# EAGLE design CaravanPi_V4 (EAGLE 9.6.2)
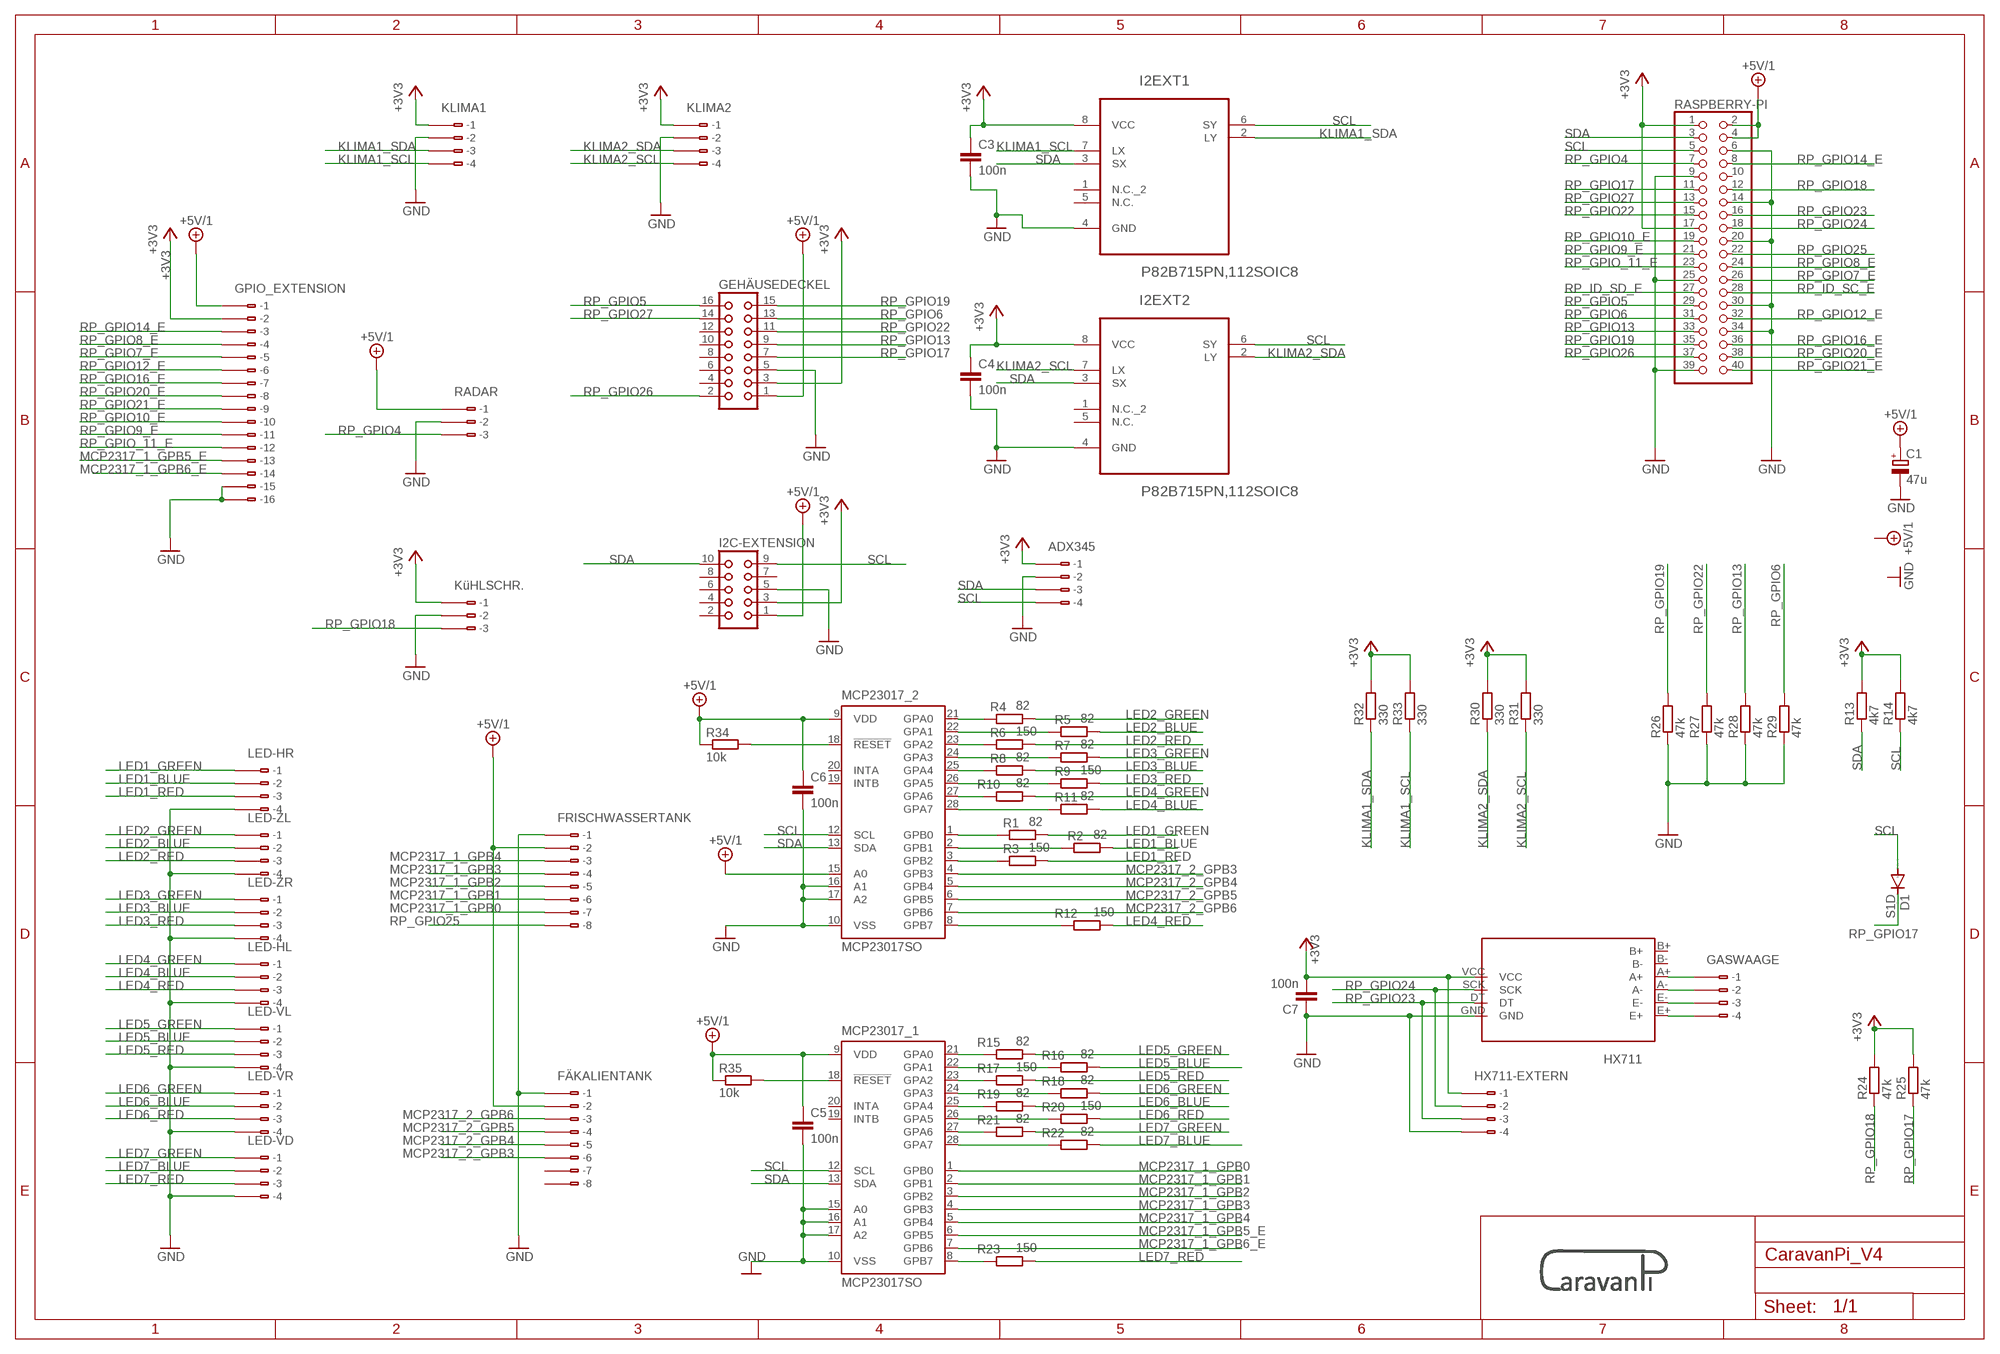
[diagram p0: schematic, sheet 1]

## Parts
ADX345  233-404  [233-404]
C1  47u  CPOL-EUSMCC  [SMC_C]
C3  100n  C-EUC1206  [C1206]
C4  100n  C-EUC1206  [C1206]
C5  100n  C-EUC1206  [C1206]
C6  100n  C-EUC1206  [C1206]
C7  100n  C-EUC1206  [C1206]
D1  S1D  DIODE-DO214AC  [DO214AC]
FRISCHWASSERTANK  233-408  [233-408]
FÄKALIENTANK  233-408  [233-408]
GASWAAGE  233-404  [233-404]
GEHÄUSEDECKEL  CON16  [CON16]
GPIO_EXTENSION  233-516  [233-516]
HX711  HX711A  [HX711]
HX711-EXTERN  233-404  [233-404]
I2C-EXTENSION  CON10  [CON10]
I2EXT1  P82B715PN,112SOIC8  [SOP127P600X175-8N]
I2EXT2  P82B715PN,112SOIC8  [SOP127P600X175-8N]
KLIMA1  233-404  [233-404]
KLIMA2  233-404  [233-404]
KüHLSCHR.  233-403  [233-403]
LED-HL  233-504  [233-504]
LED-HR  233-504  [233-504]
LED-VD  233-504  [233-504]
LED-VL  233-504  [233-504]
LED-VR  233-504  [233-504]
LED-ZL  233-504  [233-504]
LED-ZR  233-504  [233-504]
MCP23017_1  MCP23017SO  [SO28W]
MCP23017_2  MCP23017SO  [SO28W]
R1  82  R-EU_M1206  [M1206]
R2  82  R-EU_M1206  [M1206]
R3  150  R-EU_M1206  [M1206]
R4  82  R-EU_M1206  [M1206]
R5  82  R-EU_M1206  [M1206]
R6  150  R-EU_M1206  [M1206]
R7  82  R-EU_M1206  [M1206]
R8  82  R-EU_M1206  [M1206]
R9  150  R-EU_M1206  [M1206]
R10  82  R-EU_M1206  [M1206]
R11  82  R-EU_M1206  [M1206]
R12  150  R-EU_M1206  [M1206]
R13  4k7  R-EU_M1206  [M1206]
R14  4k7  R-EU_M1206  [M1206]
R15  82  R-EU_M1206  [M1206]
R16  82  R-EU_M1206  [M1206]
R17  150  R-EU_M1206  [M1206]
R18  82  R-EU_M1206  [M1206]
R19  82  R-EU_M1206  [M1206]
R20  150  R-EU_M1206  [M1206]
R21  82  R-EU_M1206  [M1206]
R22  82  R-EU_M1206  [M1206]
R23  150  R-EU_M1206  [M1206]
R24  47k  R-EU_M1206  [M1206]
R25  47k  R-EU_M1206  [M1206]
R26  47k  R-EU_M1206  [M1206]
R27  47k  R-EU_M1206  [M1206]
R28  47k  R-EU_M1206  [M1206]
R29  47k  R-EU_M1206  [M1206]
R30  330  R-EU_M1206  [M1206]
R31  330  R-EU_M1206  [M1206]
R32  330  R-EU_M1206  [M1206]
R33  330  R-EU_M1206  [M1206]
R34  10k  R-EU_M1206  [M1206]
R35  10k  R-EU_M1206  [M1206]
RADAR  233-403  [233-403]
RASPBERRY-PI  PINHD-2X20  [2X20]
U$1  CARAVAN_PI_LOGO  [CARAVAN_PI_LOGO]

## Nets
+3V3 [Power]: ADX345.B1(B-1) C3.1 C4.1 C7.2 GEHÄUSEDECKEL.3 GPIO_EXTENSION.B2(B-2) HX711-EXTERN.B1(B-1) HX711.VCC I2C-EXTENSION.3 I2EXT1.8(VCC) I2EXT2.8(VCC) KLIMA1.B1(B-1) KLIMA2.B1(B-1) KüHLSCHR..B1(B-1) R13.2 R14.2 R24.2 R25.2 R30.2 R31.2 R32.2 R33.2 RASPBERRY-PI.1 RASPBERRY-PI.17
+5V/1 [Power]: C1.+ C5.1 C6.1 FRISCHWASSERTANK.B2(B-2) FÄKALIENTANK.B2(B-2) GEHÄUSEDECKEL.1 GPIO_EXTENSION.B1(B-1) I2C-EXTENSION.1 MCP23017_1.9(VDD) MCP23017_2.9(VDD) MCP23017_2.15(A0) R34.1 R35.1 RADAR.B1(B-1) RASPBERRY-PI.2 RASPBERRY-PI.4
GND [Power]: ADX345.B2(B-2) C1.- C3.2 C4.2 C5.2 C6.2 C7.1 FRISCHWASSERTANK.B1(B-1) FÄKALIENTANK.B1(B-1) GEHÄUSEDECKEL.5 GPIO_EXTENSION.B15(B-15) GPIO_EXTENSION.B16(B-16) HX711-EXTERN.B4(B-4) HX711.GND I2C-EXTENSION.5 I2EXT1.4(GND) I2EXT2.4(GND) KLIMA1.B2(B-2) KLIMA2.B2(B-2) KüHLSCHR..B2(B-2) LED-HL.B4(B-4) LED-HR.B4(B-4) LED-VD.B4(B-4) LED-VL.B4(B-4) LED-VR.B4(B-4) LED-ZL.B4(B-4) LED-ZR.B4(B-4) MCP23017_1.10(VSS) MCP23017_1.15(A0) MCP23017_1.16(A1) MCP23017_1.17(A2) MCP23017_2.10(VSS) MCP23017_2.16(A1) MCP23017_2.17(A2) R26.1 R27.1 R28.1 R29.1 RADAR.B2(B-2) RASPBERRY-PI.6 RASPBERRY-PI.9 RASPBERRY-PI.14 RASPBERRY-PI.20 RASPBERRY-PI.25 RASPBERRY-PI.30 RASPBERRY-PI.34 RASPBERRY-PI.39
KLIMA1_SCL: I2EXT1.7(LX) KLIMA1.B4(B-4) R33.1
KLIMA1_SDA: I2EXT1.2(LY) KLIMA1.B3(B-3) R32.1
KLIMA2_SCL: I2EXT2.7(LX) KLIMA2.B4(B-4) R31.1
KLIMA2_SDA: I2EXT2.2(LY) KLIMA2.B3(B-3) R30.1
LED1_BLUE: LED-HR.B2(B-2) R2.2
LED1_GREEN: LED-HR.B1(B-1) R1.2
LED1_RED: LED-HR.B3(B-3) R3.2
LED2_BLUE: LED-ZL.B2(B-2) R5.2
LED2_GREEN: LED-ZL.B1(B-1) R4.2
LED2_RED: LED-ZL.B3(B-3) R6.2
LED3_BLUE: LED-ZR.B2(B-2) R8.2
LED3_GREEN: LED-ZR.B1(B-1) R7.2
LED3_RED: LED-ZR.B3(B-3) R9.2
LED4_BLUE: LED-HL.B2(B-2) R11.2
LED4_GREEN: LED-HL.B1(B-1) R10.2
LED4_RED: LED-HL.B3(B-3) R12.2
LED5_BLUE: LED-VL.B2(B-2) R16.2
LED5_GREEN: LED-VL.B1(B-1) R15.2
LED5_RED: LED-VL.B3(B-3) R17.2
LED6_BLUE: LED-VR.B2(B-2) R19.2
LED6_GREEN: LED-VR.B1(B-1) R18.2
LED6_RED: LED-VR.B3(B-3) R20.2
LED7_BLUE: LED-VD.B2(B-2) R22.2
LED7_GREEN: LED-VD.B1(B-1) R21.2
LED7_RED: LED-VD.B3(B-3) R23.2
MCP2317_1_GPB0: FRISCHWASSERTANK.B7(B-7) MCP23017_1.1(GPB0)
MCP2317_1_GPB1: FRISCHWASSERTANK.B6(B-6) MCP23017_1.2(GPB1)
MCP2317_1_GPB2: FRISCHWASSERTANK.B5(B-5) MCP23017_1.3(GPB2)
MCP2317_1_GPB3: FRISCHWASSERTANK.B4(B-4) MCP23017_1.4(GPB3)
MCP2317_1_GPB4: FRISCHWASSERTANK.B3(B-3) MCP23017_1.5(GPB4)
MCP2317_1_GPB5_E: GPIO_EXTENSION.B13(B-13) MCP23017_1.6(GPB5)
MCP2317_1_GPB6_E: GPIO_EXTENSION.B14(B-14) MCP23017_1.7(GPB6)
MCP2317_2_GPB3: FÄKALIENTANK.B6(B-6) MCP23017_2.4(GPB3)
MCP2317_2_GPB4: FÄKALIENTANK.B5(B-5) MCP23017_2.5(GPB4)
MCP2317_2_GPB5: FÄKALIENTANK.B4(B-4) MCP23017_2.6(GPB5)
MCP2317_2_GPB6: FÄKALIENTANK.B3(B-3) MCP23017_2.7(GPB6)
N$1: MCP23017_2.1(GPB0) R1.1
N$2: MCP23017_2.2(GPB1) R2.1
N$3: MCP23017_2.3(GPB2) R3.1
N$4: MCP23017_2.21(GPA0) R4.1
N$5: MCP23017_2.22(GPA1) R5.1
N$6: MCP23017_2.23(GPA2) R6.1
N$7: MCP23017_2.24(GPA3) R7.1
N$8: MCP23017_2.25(GPA4) R8.1
N$9: MCP23017_2.26(GPA5) R9.1
N$10: MCP23017_2.27(GPA6) R10.1
N$11: MCP23017_2.28(GPA7) R11.1
N$12: MCP23017_2.8(GPB7) R12.1
N$13: MCP23017_1.21(GPA0) R15.1
N$14: MCP23017_1.22(GPA1) R16.1
N$15: MCP23017_1.23(GPA2) R17.1
N$16: MCP23017_1.24(GPA3) R18.1
N$17: MCP23017_1.25(GPA4) R19.1
N$18: MCP23017_1.26(GPA5) R20.1
N$19: MCP23017_1.27(GPA6) R21.1
N$20: MCP23017_1.28(GPA7) R22.1
N$21: MCP23017_2.18(!RESET) R34.2
N$22: MCP23017_1.18(!RESET) R35.2
N$23: GASWAAGE.B4(B-4) HX711.E+
N$24: GASWAAGE.B3(B-3) HX711.E-
N$25: GASWAAGE.B2(B-2) HX711.A-
N$26: GASWAAGE.B1(B-1) HX711.A+
N$29: MCP23017_1.8(GPB7) R23.1
RP_GPIO4: RADAR.B3(B-3) RASPBERRY-PI.7
RP_GPIO5: GEHÄUSEDECKEL.16 RASPBERRY-PI.29
RP_GPIO6: GEHÄUSEDECKEL.13 R29.2 RASPBERRY-PI.31
RP_GPIO7_E: GPIO_EXTENSION.B5(B-5) RASPBERRY-PI.26
RP_GPIO8_E: GPIO_EXTENSION.B4(B-4) RASPBERRY-PI.24
RP_GPIO9_E: GPIO_EXTENSION.B11(B-11) RASPBERRY-PI.21
RP_GPIO10_E: GPIO_EXTENSION.B10(B-10) RASPBERRY-PI.19
RP_GPIO12_E: GPIO_EXTENSION.B6(B-6) RASPBERRY-PI.32
RP_GPIO13: GEHÄUSEDECKEL.9 R28.2 RASPBERRY-PI.33
RP_GPIO14_E: GPIO_EXTENSION.B3(B-3) RASPBERRY-PI.8
RP_GPIO16_E: GPIO_EXTENSION.B7(B-7) RASPBERRY-PI.36
RP_GPIO17: D1.C GEHÄUSEDECKEL.7 R25.1 RASPBERRY-PI.11
RP_GPIO18: KüHLSCHR..B3(B-3) R24.1 RASPBERRY-PI.12
RP_GPIO19: GEHÄUSEDECKEL.15 R26.2 RASPBERRY-PI.35
RP_GPIO20_E: GPIO_EXTENSION.B8(B-8) RASPBERRY-PI.38
RP_GPIO21_E: GPIO_EXTENSION.B9(B-9) RASPBERRY-PI.40
RP_GPIO22: GEHÄUSEDECKEL.11 R27.2 RASPBERRY-PI.15
RP_GPIO23: HX711-EXTERN.B3(B-3) HX711.DT RASPBERRY-PI.16
RP_GPIO24: HX711-EXTERN.B2(B-2) HX711.SCK RASPBERRY-PI.18
RP_GPIO25: FRISCHWASSERTANK.B8(B-8) RASPBERRY-PI.22
RP_GPIO26: GEHÄUSEDECKEL.2 RASPBERRY-PI.37
RP_GPIO27: GEHÄUSEDECKEL.14 RASPBERRY-PI.13
RP_GPIO_11_E: GPIO_EXTENSION.B12(B-12) RASPBERRY-PI.23
RP_ID_SC_E: RASPBERRY-PI.28
RP_ID_SD_E: RASPBERRY-PI.27
SCL: ADX345.B4(B-4) D1.A I2C-EXTENSION.9 I2EXT1.6(SY) I2EXT2.6(SY) MCP23017_1.12(SCL) MCP23017_2.12(SCL) R14.1 RASPBERRY-PI.5
SDA: ADX345.B3(B-3) I2C-EXTENSION.10 I2EXT1.3(SX) I2EXT2.3(SX) MCP23017_1.13(SDA) MCP23017_2.13(SDA) R13.1 RASPBERRY-PI.3
Unconnected: ADX345.A1(-1) ADX345.A2(-2) ADX345.A3(-3) ADX345.A4(-4) FRISCHWASSERTANK.A1(-1) FRISCHWASSERTANK.A2(-2) FRISCHWASSERTANK.A3(-3) FRISCHWASSERTANK.A4(-4) FRISCHWASSERTANK.A5(-5) FRISCHWASSERTANK.A6(-6) FRISCHWASSERTANK.A7(-7) FRISCHWASSERTANK.A8(-8) FÄKALIENTANK.A1(-1) FÄKALIENTANK.A2(-2) FÄKALIENTANK.A3(-3) FÄKALIENTANK.A4(-4) FÄKALIENTANK.A5(-5) FÄKALIENTANK.A6(-6) FÄKALIENTANK.A7(-7) FÄKALIENTANK.A8(-8) FÄKALIENTANK.B7(B-7) FÄKALIENTANK.B8(B-8) GASWAAGE.A1(-1) GASWAAGE.A2(-2) GASWAAGE.A3(-3) GASWAAGE.A4(-4) GEHÄUSEDECKEL.4 GEHÄUSEDECKEL.6 GEHÄUSEDECKEL.8 GEHÄUSEDECKEL.10 GEHÄUSEDECKEL.12 GPIO_EXTENSION.A1(-1) GPIO_EXTENSION.A2(-2) GPIO_EXTENSION.A3(-3) GPIO_EXTENSION.A4(-4) GPIO_EXTENSION.A5(-5) GPIO_EXTENSION.A6(-6) GPIO_EXTENSION.A7(-7) GPIO_EXTENSION.A8(-8) GPIO_EXTENSION.A9(-9) GPIO_EXTENSION.A10(-10) GPIO_EXTENSION.A11(-11) GPIO_EXTENSION.A12(-12) GPIO_EXTENSION.A13(-13) GPIO_EXTENSION.A14(-14) GPIO_EXTENSION.A15(-15) GPIO_EXTENSION.A16(-16) HX711-EXTERN.A1(-1) HX711-EXTERN.A2(-2) HX711-EXTERN.A3(-3) HX711-EXTERN.A4(-4) HX711.B+ HX711.B- I2C-EXTENSION.2 I2C-EXTENSION.4 I2C-EXTENSION.6 I2C-EXTENSION.7 I2C-EXTENSION.8 I2EXT1.1(N.C._2) I2EXT1.5(N.C.) I2EXT2.1(N.C._2) I2EXT2.5(N.C.) KLIMA1.A1(-1) KLIMA1.A2(-2) KLIMA1.A3(-3) KLIMA1.A4(-4) KLIMA2.A1(-1) KLIMA2.A2(-2) KLIMA2.A3(-3) KLIMA2.A4(-4) KüHLSCHR..A1(-1) KüHLSCHR..A2(-2) KüHLSCHR..A3(-3) LED-HL.A1(-1) LED-HL.A2(-2) LED-HL.A3(-3) LED-HL.A4(-4) LED-HR.A1(-1) LED-HR.A2(-2) LED-HR.A3(-3) LED-HR.A4(-4) LED-VD.A1(-1) LED-VD.A2(-2) LED-VD.A3(-3) LED-VD.A4(-4) LED-VL.A1(-1) LED-VL.A2(-2) LED-VL.A3(-3) LED-VL.A4(-4) LED-VR.A1(-1) LED-VR.A2(-2) LED-VR.A3(-3) LED-VR.A4(-4) LED-ZL.A1(-1) LED-ZL.A2(-2) LED-ZL.A3(-3) LED-ZL.A4(-4) LED-ZR.A1(-1) LED-ZR.A2(-2) LED-ZR.A3(-3) LED-ZR.A4(-4) MCP23017_1.19(INTB) MCP23017_1.20(INTA) MCP23017_2.19(INTB) MCP23017_2.20(INTA) RADAR.A1(-1) RADAR.A2(-2) RADAR.A3(-3) RASPBERRY-PI.10

## Library data of the parts
ADX345 GASWAAGE HX711-EXTERN KLIMA1 KLIMA2 = con-wago:233-404: WAGO Cage Clamp; MPN: 233-404; OC_FARNELL: 1601355; OC_NEWARK: 28K9077
C1 = rcl:CPOL-EU: POLARIZED CAPACITOR, European symbol
C3-C7 = rcl:C-EU: CAPACITOR, European symbol; SPICEPREFIX: C
D1 = diode:DIODE-: DIODE
FRISCHWASSERTANK FÄKALIENTANK = con-wago:233-408: WAGO Cage Clamp; MPN: 233-408; OC_FARNELL: 1601358; OC_NEWARK: 28K9080
GEHÄUSEDECKEL = con-harting:CON16: CONNECTOR; OC_FARNELL: unknown; OC_NEWARK: unknown
GPIO_EXTENSION = con-wago:233-516: WAGO Cage Clamp; MF: Wago Corporation; MPN: 0233-0516; OC_FARNELL: 1777103; OC_NEWARK: 79K2056
HX711 = HX711:HX711
I2C-EXTENSION = con-harting:CON10: CONNECTOR; OC_FARNELL: unknown; OC_NEWARK: unknown
I2EXT1 I2EXT2 = NXP_By_element14_Batch_1:P82B715PN,112: I2C-bus extender
KüHLSCHR. RADAR = con-wago:233-403: WAGO Cage Clamp; MPN: 233-403; OC_FARNELL: 1601354; OC_NEWARK: 28K9076
LED-HL LED-HR LED-VD LED-VL LED-VR LED-ZL LED-ZR = con-wago:233-504: WAGO Cage Clamp; MF: Wago Corporation; MPN: 0233-0504; OC_FARNELL: 1777098; OC_NEWARK: 79K2050
MCP23017_1 MCP23017_2 = adafruit:MCP23017: http://ww1.microchip.com/downloads/en/DeviceDoc/21952a.pdf Source: http://ww1.microchip.com/downloads/en/DeviceDoc/21952a.pdf
R1-R35 = rcl:R-EU_: RESISTOR, European symbol; SPICEPREFIX: R
RASPBERRY-PI = pinhead:PINHD-2X20: PIN HEADER
U$1 = caravanPI_logo:CARAVAN_PI_LOGO: Caravan_PI_logo

## Net classes
0 default: width 0.508 mm, drill 0.305 mm
1 Power: width 1.016 mm

## Board
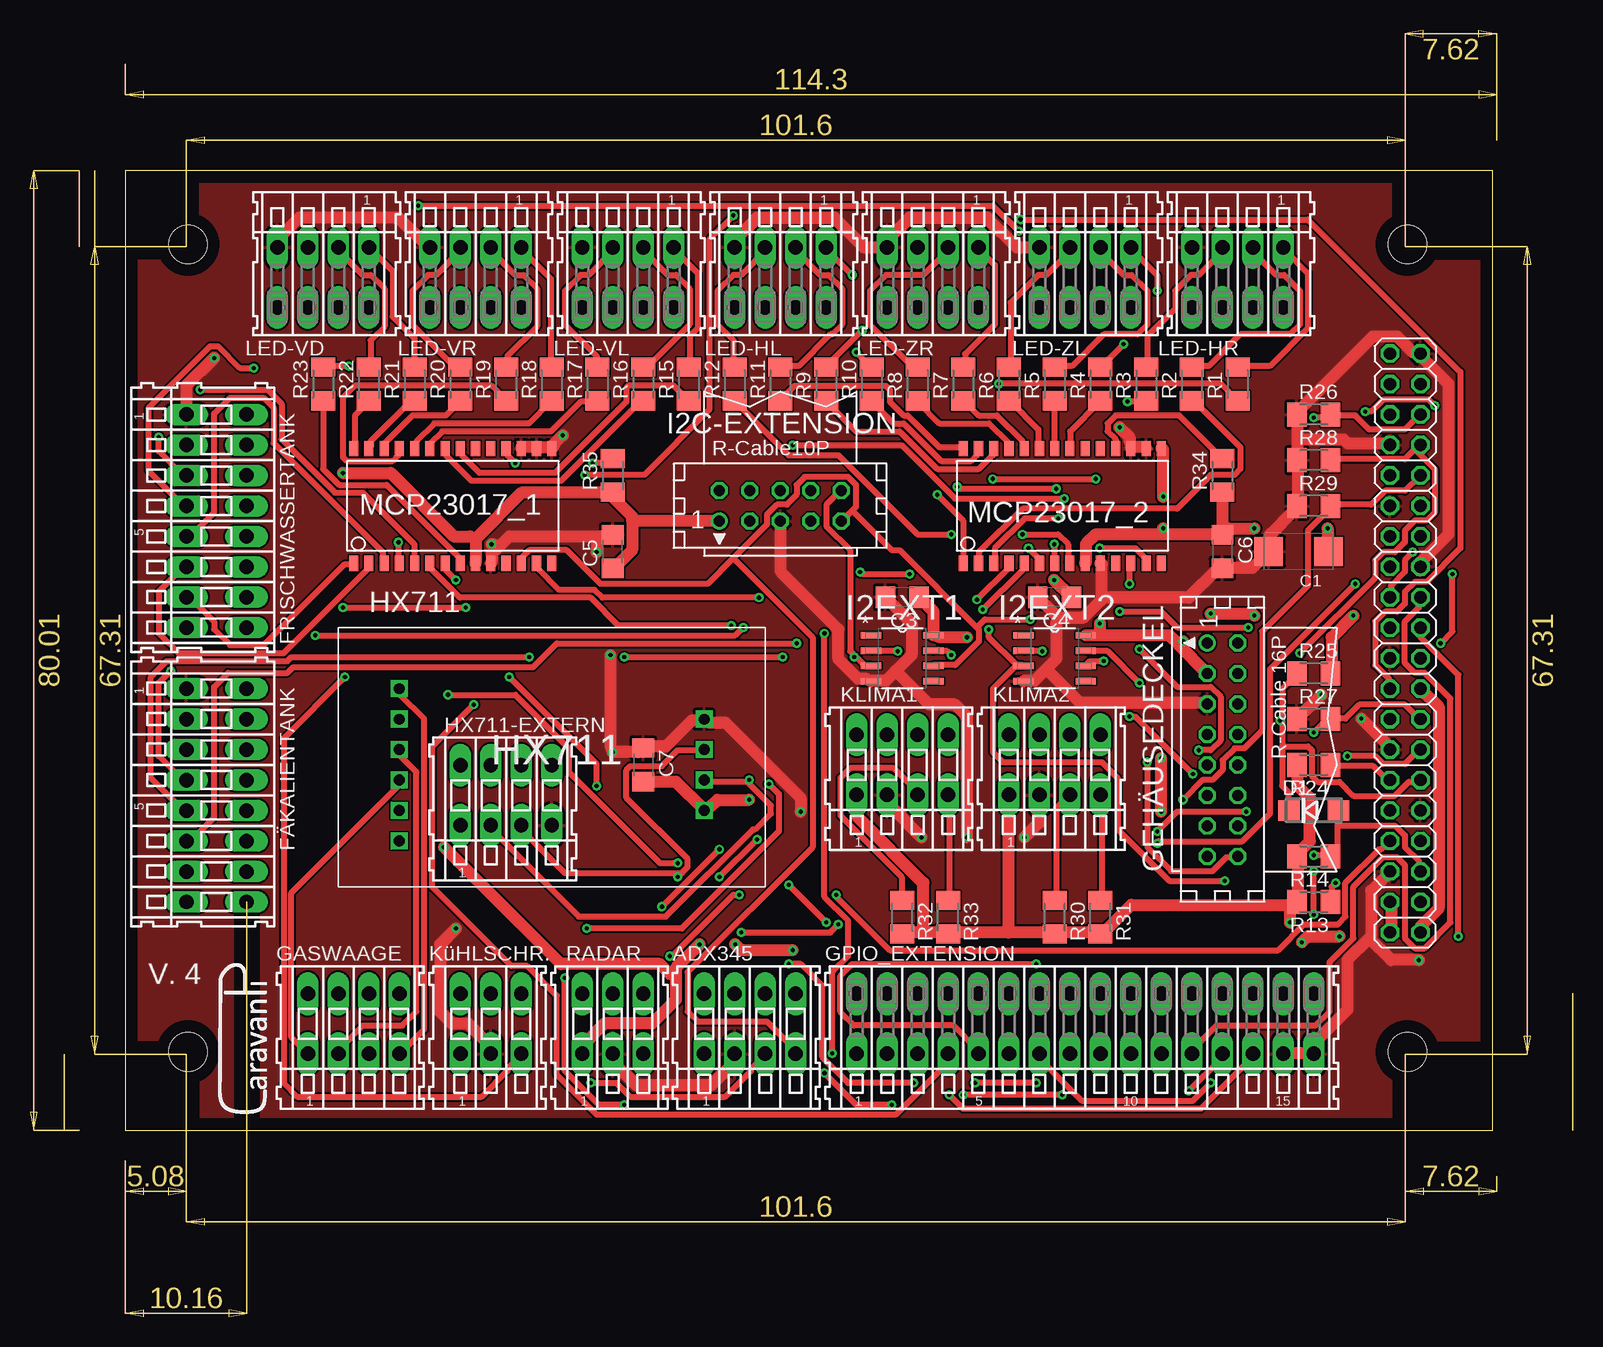
[diagram p1: board, top side]
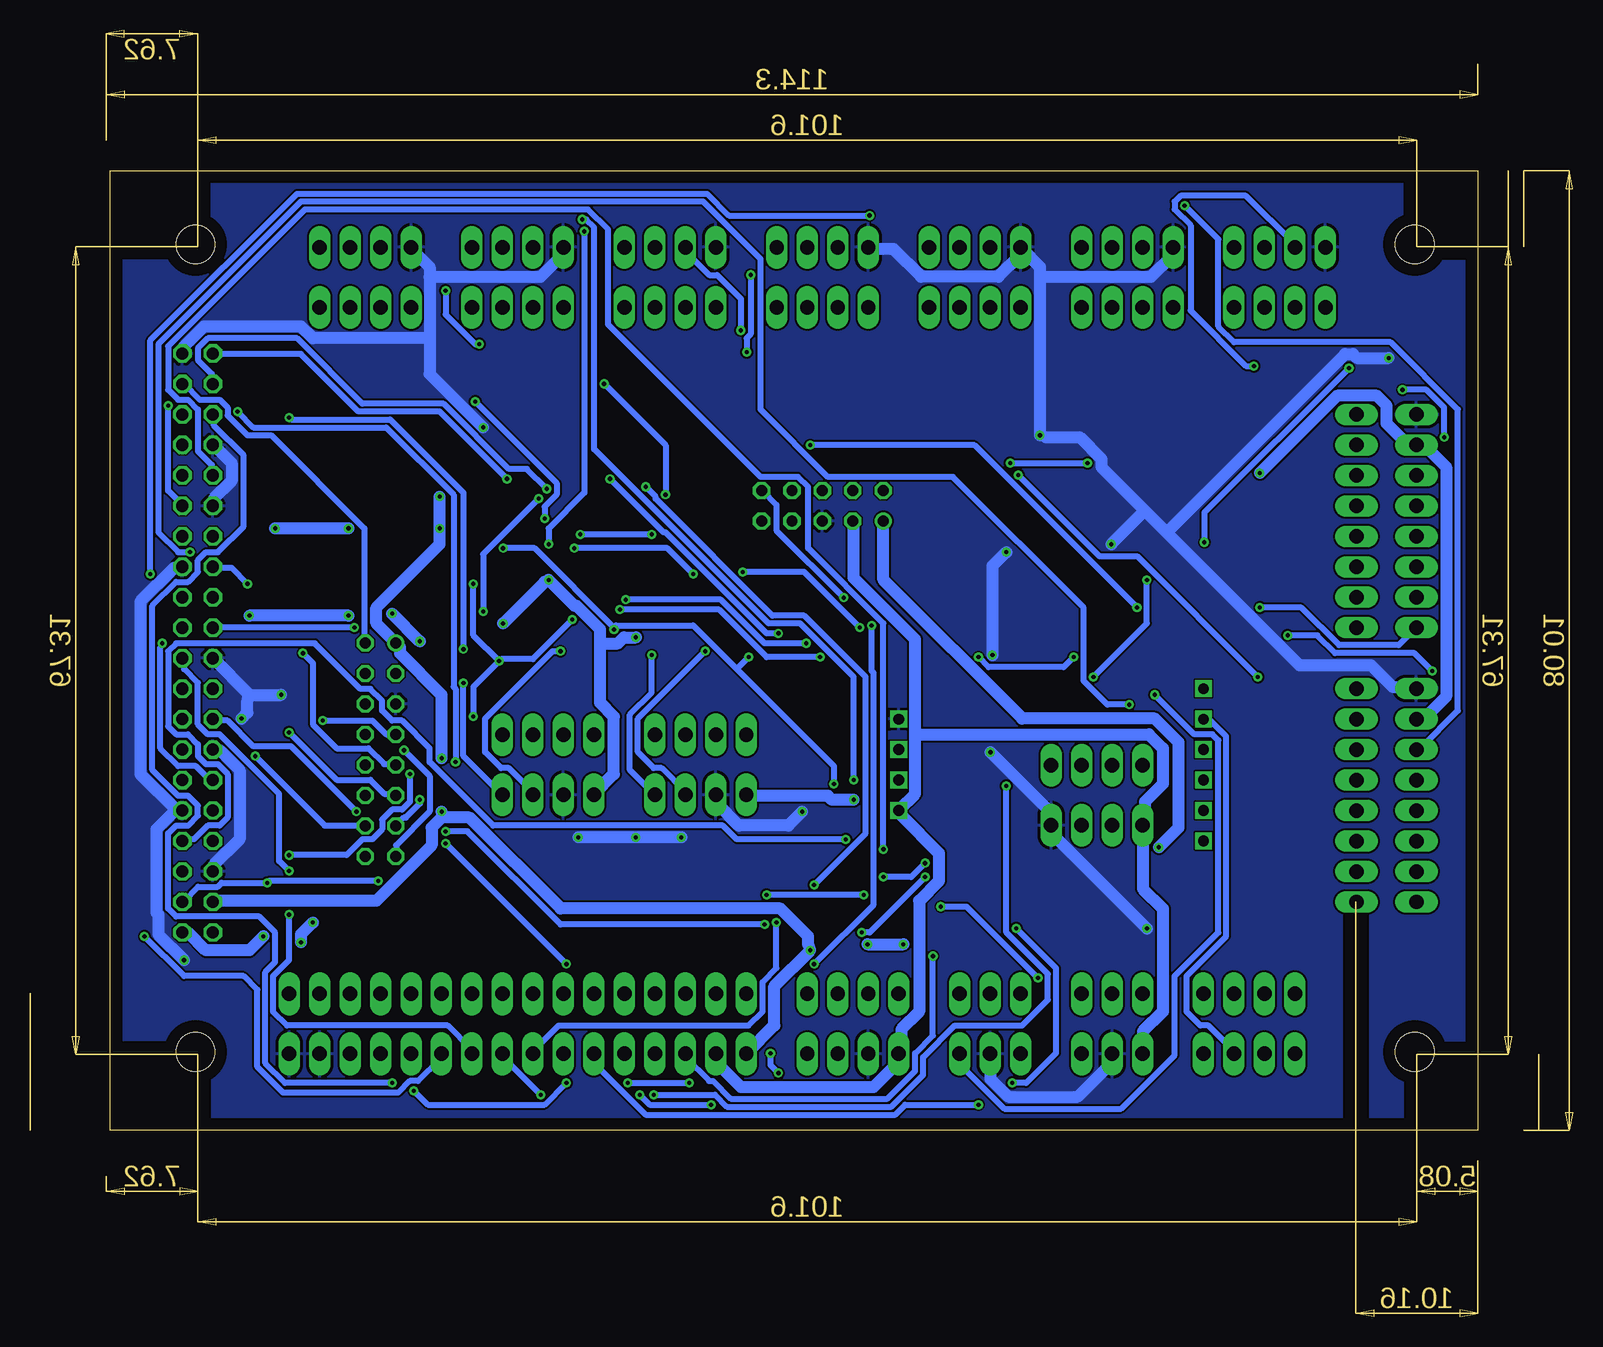
[diagram p2: board, bottom side, seen from below]

Size 113.97 x 80 mm. Coordinates in mm from the lower left corner, seen from the top.
Outline: 0,0 113.97,0 113.97,80 0,80 0,0
Copper layers (1*16): Top 0.035mm / dielectric 1.5mm / Bottom 0.035mm
Design rules "default": minimum track width 6mil, minimum drill 0.35mm, track to track 6mil, track to pad 6mil, pad to pad 6mil, via to via 6mil, smd to smd 6mil, copper to edge 40mil, drill to drill 6mil, minimum pad ring 10mil, minimum via ring 8mil, stop-mask expansion 4mil, vias tented up to drill 0mil, thermal gap 10mil
Holes 3.2 mm at 5.25,73.86 106.86,73.86 106.86,6.55 5.25,6.55

### Footprints (pad centres in the part's own frame; a part is rotated, then mirrored left to right if it is on the bottom)
233-404 = drill 1.2 long: A1 -3.81,2.5; A2 -1.27,2.5; A3 1.27,2.5; A4 3.81,2.5; B1 -3.81,-2.5; B2 -1.27,-2.5; B3 1.27,-2.5; B4 3.81,-2.5
SMC_C = smd 2.4 x 2.4: + -2.5,0; - 2.5,0
C1206 = smd 1.6 x 1.8: 1 -1.4,0; 2 1.4,0
DO214AC = smd 1.8 x 1.7: A 2.05,0; C -2.05,0
233-408 = drill 1.2 long: A1 -8.89,2.5; A2 -6.35,2.5; A3 -3.81,2.5; A4 -1.27,2.5; A5 1.27,2.5; A6 3.81,2.5; A7 6.35,2.5; A8 8.89,2.5; B1 -8.89,-2.5; B2 -6.35,-2.5; B3 -3.81,-2.5; B4 -1.27,-2.5; B5 1.27,-2.5; B6 3.81,-2.5; B7 6.35,-2.5; B8 8.89,-2.5
CON16 = drill 0.914: 1 -8.89,-1.27 | drill 0.914 octagon: 2 -8.89,1.27; 3 -6.35,-1.27; 4 -6.35,1.27; 5 -3.81,-1.27; 6 -3.81,1.27; 7 -1.27,-1.27; 8 -1.27,1.27; 9 1.27,-1.27; 10 1.27,1.27; 11 3.81,-1.27; 12 3.81,1.27; 13 6.35,-1.27; 14 6.35,1.27; 15 8.89,-1.27; 16 8.89,1.27
233-516 = drill 1.2 long: A1 -19.05,2.5; A2 -16.51,2.5; A3 -13.97,2.5; A4 -11.43,2.5; A5 -8.89,2.5; A6 -6.35,2.5; A7 -3.81,2.5; A8 -1.27,2.5; A9 1.27,2.5; A10 3.81,2.5; A11 6.35,2.5; A12 8.89,2.5; A13 11.43,2.5; A14 13.97,2.5; A15 16.51,2.5; A16 19.05,2.5; B1 -19.05,-2.5; B2 -16.51,-2.5; B3 -13.97,-2.5; B4 -11.43,-2.5; B5 -8.89,-2.5; B6 -6.35,-2.5; B7 -3.81,-2.5; B8 -1.27,-2.5; B9 1.27,-2.5; B10 3.81,-2.5; B11 6.35,-2.5; B12 8.89,-2.5; B13 11.43,-2.5; B14 13.97,-2.5; B15 16.51,-2.5; B16 19.05,-2.5
HX711 = drill 0.9 square: A+ 5.08,8.89; A- 5.08,11.43; B+ 5.08,3.81; B- 5.08,6.35; DT 30.48,11.43; E+ 5.08,16.51; E- 5.08,13.97; GND 30.48,13.97; SCK 30.48,8.89; VCC 30.48,6.35
CON10 = drill 0.914: 1 -5.08,-1.27 | drill 0.914 octagon: 2 -5.08,1.27; 3 -2.54,-1.27; 4 -2.54,1.27; 5 0,-1.27; 6 0,1.27; 7 2.54,-1.27; 8 2.54,1.27; 9 5.08,-1.27; 10 5.08,1.27
SOP127P600X175-8N = smd 1.702 x 0.533: 1 -2.591,1.905; 2 -2.591,0.635; 3 -2.591,-0.635; 4 -2.591,-1.905; 5 2.591,-1.905; 6 2.591,-0.635; 7 2.591,0.635; 8 2.591,1.905
233-403 = drill 1.2 long: A1 -2.54,2.5; A2 0,2.5; A3 2.54,2.5; B1 -2.54,-2.5; B2 0,-2.5; B3 2.54,-2.5
233-504 = drill 1.2 long: A1 -3.81,2.5; A2 -1.27,2.5; A3 1.27,2.5; A4 3.81,2.5; B1 -3.81,-2.5; B2 -1.27,-2.5; B3 1.27,-2.5; B4 3.81,-2.5
SO28W = smd 0.762 x 1.27: 1 -7.62,-4.78; 2 -6.35,-4.78; 3 -5.08,-4.78; 4 -3.81,-4.78; 5 -2.54,-4.78; 6 -1.27,-4.78; 7 0,-4.78; 8 1.27,-4.78; 9 2.54,-4.78; 10 3.81,-4.78; 11 5.08,-4.78; 12 6.35,-4.78; 13 7.62,-4.78; 14 8.89,-4.78; 15 8.89,4.78; 16 7.62,4.78; 17 6.35,4.78; 18 5.08,4.78; 19 3.81,4.78; 20 2.54,4.78; 21 1.27,4.78; 22 0,4.78; 23 -1.27,4.78; 24 -2.54,4.78; 25 -3.81,4.78; 26 -5.08,4.78; 27 -6.35,4.78; 28 -7.62,4.78
M1206 = smd 1.6 x 2: 1 -1.4,0; 2 1.4,0
2X20 = drill 1.016 octagon: 1 -24.13,-1.27; 2 -24.13,1.27; 3 -21.59,-1.27; 4 -21.59,1.27; 5 -19.05,-1.27; 6 -19.05,1.27; 7 -16.51,-1.27; 8 -16.51,1.27; 9 -13.97,-1.27; 10 -13.97,1.27; 11 -11.43,-1.27; 12 -11.43,1.27; 13 -8.89,-1.27; 14 -8.89,1.27; 15 -6.35,-1.27; 16 -6.35,1.27; 17 -3.81,-1.27; 18 -3.81,1.27; 19 -1.27,-1.27; 20 -1.27,1.27; 21 1.27,-1.27; 22 1.27,1.27; 23 3.81,-1.27; 24 3.81,1.27; 25 6.35,-1.27; 26 6.35,1.27; 27 8.89,-1.27; 28 8.89,1.27; 29 11.43,-1.27; 30 11.43,1.27; 31 13.97,-1.27; 32 13.97,1.27; 33 16.51,-1.27; 34 16.51,1.27; 35 19.05,-1.27; 36 19.05,1.27; 37 21.59,-1.27; 38 21.59,1.27; 39 24.13,-1.27; 40 24.13,1.27

### Placement (x,y rotation side)
ADX345  52.07,8.89 0 top
C1  97.79,48.26 180 top
C3  64.77,44.45 180 top
C4  77.47,44.45 180 top
C5  40.64,48.26 90 top
C6  91.44,48.26 270 top
C7  43.18,30.48 270 top
D1  99.06,26.67 0 top
FRISCHWASSERTANK  7.62,50.8 270 top
FÄKALIENTANK  7.62,27.94 270 top
GASWAAGE  19.05,8.89 0 top
GEHÄUSEDECKEL  91.44,31.75 270 top
GPIO_EXTENSION  80.01,8.89 0 top
HX711  17.78,20.32 0 top
HX711-EXTERN  31.75,27.94 0 top
I2C-EXTENSION  54.61,52.07 0 top
I2EXT1  64.77,39.37 0 top
I2EXT2  77.47,39.37 0 top
KLIMA1  64.77,30.48 0 top
KLIMA2  77.47,30.48 0 top
KüHLSCHR.  30.48,8.89 0 top
LED-HL  54.61,71.12 180 top
LED-HR  92.71,71.12 180 top
LED-VD  16.51,71.12 180 top
LED-VL  41.91,71.12 180 top
LED-VR  29.21,71.12 180 top
LED-ZL  80.01,71.12 180 top
LED-ZR  67.31,71.12 180 top
MCP23017_1  26.67,52.07 0 top
MCP23017_2  77.47,52.07 0 top
R1  92.71,62.23 90 top
R2  88.9,62.23 90 top
R3  85.09,62.23 90 top
R4  81.28,62.23 90 top
R5  77.47,62.23 90 top
R6  73.66,62.23 90 top
R7  69.85,62.23 90 top
R8  66.04,62.23 90 top
R9  58.42,62.23 90 top
R10  62.23,62.23 90 top
R11  54.61,62.23 90 top
R12  50.8,62.23 90 top
R13  99.06,19.05 180 top
R14  99.06,22.86 180 top
R15  46.99,62.23 90 top
R16  43.18,62.23 90 top
R17  39.37,62.23 90 top
R18  35.56,62.23 90 top
R19  31.75,62.23 90 top
R20  27.94,62.23 90 top
R21  24.13,62.23 90 top
R22  20.32,62.23 90 top
R23  16.51,62.23 90 top
R24  99.06,30.48 180 top
R25  99.06,38.1 0 top
R26  99.06,59.69 0 top
R27  99.06,34.29 0 top
R28  99.06,55.88 0 top
R29  99.06,52.07 0 top
R30  77.47,17.78 270 top
R31  81.28,17.78 270 top
R32  64.77,17.78 270 top
R33  68.58,17.78 270 top
R34  91.44,54.61 90 top
R35  40.64,54.61 90 top
RADAR  40.64,8.89 0 top
RASPBERRY-PI  106.68,40.64 90 top
U$1  12.7,1.27 90 top

### Tracks (layer width: path | path; a pad name or v marks a point on that pad's centre or on a via)
+3V3  (via drill 0.35)
  Top 1.016: 81.23,41.27 87.01,41.27 87.83,40.45 | 81.23,41.27 I2EXT2.8 | 87.83,40.45 90.14,38.14 GEHÄUSEDECKEL.3 | v102.36,42.93 100.55,41.11 100.55,38.14 R25.2 | v94.11,42.93 93.94,43.09 v90.47,43.09 | v88.16,40.78 87.83,40.45 | C3.1 66.2,44.41 67.36,43.26 I2EXT1.8 67.86,41.11 v70.17,41.11 | v77.43,45.9 78.75,44.58 C4.1 | v81.23,42.27 81.23,41.27 | RASPBERRY-PI.1 107.97,16.51 107.97,17 109.46,18.49 109.46,35.33 107.97,36.82 RASPBERRY-PI.17 | R13.2 97.74,19.15 97.74,22.78 R14.2 97.9,23.28 98.73,24.11 98.73,27.74 97.74,28.73 97.74,30.38 R24.2 | 66.53,16.51 68.52,16.51 R33.2 69.01,16.51 73.64,16.51 | 66.53,16.51 64.88,16.51 R32.2 | 73.64,16.51 77.1,16.51 R30.2 77.6,16.51 81.23,16.51 R31.2 81.72,16.68 83.87,18.82 97.24,18.82 R13.2 | 66.53,16.51 66.53,20.64 61.09,26.09 61.09,27.9 KLIMA1.B1 | v101.21,16.18 98.56,16.18 v98.07,15.68 | v97.08,17.34 97.08,18.33 R13.2 | 73.64,16.51 73.64,27.9 KLIMA2.B1 | C7.2 43.26,29.06 45.9,29.06 48.21,26.75 HX711.VCC 48.7,26.91 49.37,27.57 v52.01,27.57
  Bottom 1.016: v94.11,42.93 v102.36,42.93 | v88.16,40.78 v90.47,43.09 | 73.14,40.62 73.14,35.66 71.98,34.51 71.98,29.72 73.64,28.07 KLIMA2.B1 | 73.14,40.62 73.14,41.77 75.12,43.75 75.29,43.75 v77.43,45.9 77.76,45.73 v81.23,42.27 | v70.17,41.11 71.16,41.11 71.65,40.62 73.14,40.62 | RASPBERRY-PI.1 107.48,16.51 105.99,15.02 102.36,15.02 v101.21,16.18 | v98.07,15.68 98.07,16.34 v97.08,17.34 | KüHLSCHR..B1 27.9,6.44 27.9,8.26 26.25,9.91 26.25,18.49 27.9,20.14 27.9,25.43 HX711-EXTERN.B1 27.74,25.92 27.74,27.41 26.25,28.89 26.25,31.86 27.41,33.02 46.89,33.02 | GPIO_EXTENSION.B2 63.4,6.27 63.4,5.61 61.42,3.63 50.35,3.63 48.37,5.61 48.37,6.27 ADX345.B1 48.04,6.77 48.04,8.42 46.56,9.91 46.56,19.15 44.91,20.8 44.91,23.11 48.04,26.25 HX711.VCC 48.21,26.75 46.89,28.07 46.89,33.02 | 46.89,33.02 46.89,40.95 52.01,46.06 52.01,50.69 I2C-EXTENSION.3 | v52.01,27.57 53.82,27.57 54.15,27.9 60.92,27.9 KLIMA1.B1
+5V/1  (via drill 0.35)
  Top 1.016: 29.22,49.37 29.22,47.38 MCP23017_1.9 | 29.22,49.37 33.02,53.16 40.62,53.16 R35.1 40.78,52.67 42.27,51.18 42.27,50.85 | 42.27,50.85 42.27,48.37 40.78,46.89 C5.1 | 42.27,50.85 49.53,50.85 I2C-EXTENSION.1 | v18.16,54.81 22.12,54.81 27.41,49.53 28.73,49.53 29.22,49.37 | v86.51,52.83 86.51,56.79 MCP23017_2.15 | 86.51,49.7 91.3,49.7 C6.1 | 86.51,49.7 80.9,49.7 80.07,48.87 80.07,47.38 MCP23017_2.9 | R34.1 91.47,53.16 91.47,50.19 C6.1 | v100.22,50.19 100.22,48.37 C1.+ | v94.11,50.19 91.96,50.19 C6.1 | v86.51,50.19 86.51,49.7 | RASPBERRY-PI.2 105.5,16.51 105.5,18.99 RASPBERRY-PI.4 | 45.9,13.04 45.9,13.54 v47.88,15.52 | 45.9,13.04 45.9,10.9 43.92,8.91 39.95,8.91 38.14,7.1 38.14,6.44 RADAR.B1 | v50.85,15.52 51.35,15.02 v55.64,15.02 | v86.35,26.58 v86.35,31.04 | v26.58,23.61 36.32,13.87 44.58,13.87 45.4,13.04 45.9,13.04
  Bottom 1.016: FÄKALIENTANK.B2 5.12,34.34 4.46,34.34 2.64,36.16 2.64,55.31 4.46,57.12 5.12,57.12 FRISCHWASSERTANK.B2 5.61,56.96 7.59,58.94 7.59,60.43 8.42,61.25 11.72,61.25 v18.16,54.81 | v86.51,52.83 v86.51,50.19 86.51,48.87 91.8,43.59 91.8,42.27 GEHÄUSEDECKEL.1 89.81,40.28 89.81,39.79 86.35,36.32 v86.35,31.04 | v94.11,50.19 v100.22,50.19 | v50.85,15.52 v47.88,15.52 | GPIO_EXTENSION.B1 60.92,6.44 58.61,8.75 58.61,12.05 v55.64,15.02 55.8,15.52 55.8,16.18 58.12,18.49 76.44,18.49 84.04,26.09 86.35,26.09 | 86.35,26.09 87.17,25.26 87.17,23.77 91.8,19.15 105.33,19.15 RASPBERRY-PI.4 | v86.35,26.58 86.35,26.09 | I2C-EXTENSION.1 49.53,45.9 37.97,34.34 26.91,34.34 24.93,32.36 24.93,25.26 v26.58,23.61
GND  (via drill 0.35)
  Top 1.016: ADX345.B2 50.69,6.27 50.69,5.61 48.87,3.8 42.6,3.8 40.78,5.61 40.78,6.27 RADAR.B2 | 64.22,38.3 65.55,39.62 65.55,42.27 63.4,44.41 C3.2 | 64.22,38.3 63.4,37.48 62.24,37.48 I2EXT1.4 61.75,37.64 61.09,37.64 59.44,39.29 59.44,41.77 54.65,46.56 54.65,50.69 I2C-EXTENSION.5 | v56.3,26.58 56.3,27.74 50.02,34.01 48.7,34.01 HX711.GND 48.21,34.18 47.22,34.18 45.07,32.03 43.26,32.03 C7.1 42.76,31.53 v40.62,31.53 40.45,32.03 v40.45,39.62 | v74.95,24.43 76.11,25.59 76.11,27.9 KLIMA2.B2 | v66.37,24.43 63.56,27.24 63.56,27.9 KLIMA1.B2 | 64.22,38.3 67.03,35.5 69.18,35.5 70.17,34.51 v70.17,24.43 | v27.57,16.84 26.25,15.52 26.25,9.91 27.24,8.91 28.56,8.91 30.38,7.1 30.38,6.44 KüHLSCHR..B2 | v99.72,36.32 97.74,34.34 R27.1 | GPIO_EXTENSION.B15 96.58,6.44 99.06,6.44 GPIO_EXTENSION.B16 99.22,6.93 99.22,7.43 101.87,10.07 101.87,14.2 103.68,16.02 | 103.68,16.02 103.85,16.18 103.85,19.98 105.33,21.46 RASPBERRY-PI.6 | v103.02,34.34 105.5,31.86 RASPBERRY-PI.14 | 81.39,44.41 81.39,44.25 79.91,42.76 77.76,42.76 | 81.39,44.41 81.39,47.22 MCP23017_2.10 | 77.76,42.76 76.11,44.41 C4.2 | 76.77,38.47 77.6,39.29 77.6,42.27 77.76,42.76 | 76.77,38.47 75.78,37.48 74.95,37.48 I2EXT2.4 | 76.77,38.47 79.58,35.66 90.14,35.66 GEHÄUSEDECKEL.5 | 97.74,57.62 97.74,56.3 R28.1 97.74,55.8 97.74,52.17 R29.1 97.41,51.68 95.43,49.7 95.43,48.7 C1.- 95.26,48.21 93.94,46.89 91.47,46.89 C6.2 90.97,46.72 88.66,44.41 81.39,44.41 | 97.74,57.62 97.74,59.6 R26.1 97.9,60.1 104.01,66.2 105.99,66.2 107.31,64.88 107.81,64.88 RASPBERRY-PI.39 108.14,64.39 110.29,62.24 110.29,49.7 107.97,47.38 107.97,47.05 RASPBERRY-PI.25
  Top 1.016: 97.74,57.62 101.54,57.62 101.87,57.29 105.33,57.29 RASPBERRY-PI.34 | 103.68,16.02 105.5,14.2 v107.81,14.2 | MCP23017_2.16 85.03,56.96 83.87,56.96 MCP23017_2.17 83.71,57.45 83.71,57.78 v82.88,58.61 | LED-VD.B4 12.71,73.64 12.71,74.3 14.53,76.11 22.78,76.11 25.26,73.64 LED-VR.B4 | 31.04,48.54 32.03,49.53 39.29,49.53 | 31.04,48.54 30.54,48.04 30.54,47.38 MCP23017_1.10 | 39.29,49.53 40.62,49.53 C5.2 | 34.18,56.96 33.02,56.96 MCP23017_1.17 | 34.18,56.96 MCP23017_1.16 | 34.18,56.96 35.5,56.96 MCP23017_1.15 35.83,57.29 v36.49,57.95 | v7.43,64.39 5.12,62.08 5.12,59.77 FRISCHWASSERTANK.B1 | LED-HL.B4 50.85,73.64 50.85,74.3 52.67,76.11 59.11,76.11 61.58,73.64 63.4,73.64 LED-ZR.B4 63.4,74.13 65.38,76.11 71.82,76.11 74.3,73.64 76.11,73.64 LED-ZL.B4 | v30.54,48.87 30.71,48.87 31.04,48.54 | 39.29,49.53 v39.29,48.21
  Bottom 1.016: KüHLSCHR..B2 30.54,6.27 30.54,5.61 33.35,2.81 39.13,2.81 40.62,4.29 40.62,6.27 RADAR.B2 | v40.62,31.53 35.66,26.58 35.66,25.59 HX711-EXTERN.B4 35.5,24.93 35.5,24.77 v27.57,16.84 | v56.3,26.58 57.45,25.43 61.58,25.43 63.4,27.24 63.4,27.9 KLIMA1.B2 | v66.37,24.43 v70.17,24.43 v74.95,24.43 | 102.36,36.32 v99.72,36.32 | RASPBERRY-PI.20 102.36,36.32 | RASPBERRY-PI.6 105.33,21.63 105.33,22.12 103.19,24.27 103.19,30.05 104.84,31.7 105.33,31.7 RASPBERRY-PI.14 | v103.02,34.34 102.53,34.84 102.53,35.83 102.36,36.32 | 108.47,26.75 107.97,26.75 RASPBERRY-PI.9 | 108.47,26.75 111.44,29.72 111.44,44.08 108.64,46.89 107.97,46.89 RASPBERRY-PI.25 | RASPBERRY-PI.30 105.33,52.17 105.33,52.67 103.85,54.15 103.85,55.64 105.33,57.12 RASPBERRY-PI.34 | v107.81,14.2 109.96,16.34 109.96,18 110.12,18.16 110.12,25.09 108.47,26.75 | v82.88,58.61 87.34,63.07 87.34,66.04 | 87.34,71.16 87.34,71.98 88.82,73.47 LED-HR.B4 | 87.34,71.16 87.34,66.04 | 87.34,71.16 78.09,71.16 76.28,72.97 76.28,73.47 LED-ZL.B4 | 36.49,71.16 36.49,71.98 37.97,73.47 LED-VL.B4 38.14,72.97 39.95,71.16 46.39,71.16 48.7,73.47 50.69,73.47 LED-HL.B4 | 36.49,71.16 v36.49,57.95 35.99,57.78 33.19,57.78 31.37,55.97 31.37,55.31 27.74,51.68 | 27.74,51.68 25.92,49.86 | 25.92,49.86 14.86,38.8 8.91,38.8 7.1,36.98 5.28,36.98 FÄKALIENTANK.B1 | v7.43,64.39 10.07,64.39 10.4,64.72 11.06,64.72 25.92,49.86 | 27.74,51.68 v30.54,48.87 | 36.49,71.16 27.24,71.16 25.43,72.97 25.43,73.47 LED-VR.B4 | 87.34,66.04 97.08,66.04 98.07,67.03 106.16,67.03 107.81,65.38 107.81,64.88 RASPBERRY-PI.39 | v40.45,39.62 40.45,47.05 v39.29,48.21
  pour Top: 0,80.01 0,0 114.3,0 114.3,80.01
  pour Bottom: 0,80.01 0,0 114.3,0 114.3,80.01
KLIMA1_SCL  (via drill 0.35)
  Top 0.508: v68.85,39.62 68.52,39.95 67.36,39.95 I2EXT1.7 | R33.1 68.68,19.32 68.68,27.9 KLIMA1.B4
  Bottom 0.508: v68.85,39.62 68.85,36.49 70.66,34.67 70.66,30.05 68.68,28.07 KLIMA1.B4
KLIMA1_SDA  (via drill 0.35)
  Top 0.508: v64.39,39.95 62.24,39.95 I2EXT1.2 | KLIMA1.B3 66.04,28.23 64.06,30.21 60.43,30.21 59.6,29.39 59.6,26.25 64.72,21.13 64.72,19.32 R32.1
  Bottom 0.508: v64.39,39.95 70,34.34 70,31.53 68.68,30.21 68.02,30.21 66.04,28.23 KLIMA1.B3
KLIMA2_SCL  (via drill 0.35)
  Top 0.508: v84.53,37.31 81.89,39.95 80.07,39.95 I2EXT2.7 | R31.1 81.39,19.32 81.39,27.9 KLIMA2.B4
  Bottom 0.508: v84.53,37.31 84.53,31.2 81.39,28.07 KLIMA2.B4
KLIMA2_SDA  (via drill 0.35)
  Top 0.508: v76.44,39.95 74.95,39.95 I2EXT2.2 | R30.1 77.6,19.32 77.6,26.91 78.59,27.9 KLIMA2.B3
  Bottom 0.508: v76.44,39.95 77.1,39.95 82.72,34.34 82.72,31.53 81.39,30.21 80.73,30.21 78.59,28.07 KLIMA2.B3
LED1_BLUE
  Top 0.508: R2.2 88.99,63.73 90.31,63.73 92.95,66.37 97.08,66.37 97.9,67.2 97.9,70 96.58,71.32 95.92,71.32 94.11,73.14 94.11,73.47 LED-HR.B2
LED1_GREEN
  Top 0.508: R1.2 92.79,63.73 95.43,63.73 98.56,66.86 98.56,71.49 96.58,73.47 LED-HR.B1
LED1_RED
  Top 0.508: R3.2 85.19,63.73 85.19,66.2 87.5,68.52 87.5,70 88.82,71.32 89.48,71.32 91.3,73.14 91.3,73.47 LED-HR.B3
LED2_BLUE
  Top 0.508: R5.2 77.6,63.73 78.92,63.73 81.56,66.37 84.37,66.37 85.19,67.2 85.19,70 83.87,71.32 83.21,71.32 81.39,73.14 81.39,73.47 LED-ZL.B2
LED2_GREEN  (via drill 0.35)
  Top 0.508: v83.21,65.55 81.39,63.73 R4.2 | v86.02,70 86.02,71.32 83.87,73.47 LED-ZL.B1
  Bottom 0.508: v83.21,65.55 83.54,65.55 86.02,68.02 v86.02,70
LED2_RED
  Top 0.508: R6.2 73.8,63.73 73.8,69.01 76.11,71.32 76.77,71.32 78.59,73.14 78.59,73.47 LED-ZL.B3
LED3_BLUE
  Top 0.508: R8.2 66.04,63.73 65.55,63.73 62.08,67.2 62.08,70 63.4,71.32 66.53,71.32 68.68,73.47 LED-ZR.B2
LED3_GREEN
  Top 0.508: R7.2 70,63.73 70,64.72 72.48,67.2 72.48,72.15 71.16,73.47 LED-ZR.B1
LED3_RED  (via drill 0.35)
  Top 0.508: v61.42,66.7 58.45,63.73 R9.2
  Bottom 0.508: v61.42,66.7 61.42,69.34 63.4,71.32 64.06,71.32 66.04,73.3 LED-ZR.B3
LED4_BLUE
  Top 0.508: R11.2 54.65,63.73 56.13,63.73 58.78,66.37 58.94,66.37 59.77,67.2 59.77,70.17 58.61,71.32 57.95,71.32 55.8,73.47 LED-HL.B2
LED4_GREEN  (via drill 0.35)
  Top 0.508: v60.92,64.88 62.08,63.73 R10.2 | v60.59,71.32 58.45,73.47 LED-HL.B1
  Bottom 0.508: v60.92,64.88 60.92,66.04 60.59,66.37 v60.59,71.32
LED4_RED
  Top 0.508: R12.2 50.69,63.73 50.69,65.88 49.37,67.2 49.37,70 50.69,71.32 51.35,71.32 53.49,73.47 LED-HL.B3
LED5_BLUE
  Top 0.508: R16.2 43.26,63.73 43.59,63.73 47.05,67.2 47.05,70.17 45.9,71.32 45.24,71.32 43.09,73.47 LED-VL.B2
LED5_GREEN
  Top 0.508: R15.2 47.05,63.73 47.05,66.2 47.71,66.86 47.71,71.49 45.73,73.47 LED-VL.B1
LED5_RED
  Top 0.508: R17.2 39.29,63.73 39.29,64.55 36.65,67.2 36.65,70 37.97,71.32 38.63,71.32 40.78,73.47 LED-VL.B3
LED6_BLUE
  Top 0.508: R19.2 31.86,63.73 31.86,64.55 34.34,67.03 34.34,70.17 33.19,71.32 32.52,71.32 30.38,73.47 LED-VR.B2
LED6_GREEN
  Top 0.508: R18.2 35.5,63.73 35.5,70.99 33.02,73.47 LED-VR.B1
LED6_RED
  Top 0.508: R20.2 27.9,63.73 27.41,63.73 23.94,67.2 23.94,70 25.26,71.32 25.92,71.32 28.07,73.47 LED-VR.B3
LED7_BLUE
  Top 0.508: R22.2 20.47,63.73 20.47,65.88 21.63,67.03 21.63,70.17 20.47,71.32 19.81,71.32 17.67,73.47 LED-VD.B2
LED7_GREEN
  Top 0.508: R21.2 24.11,63.73 24.11,66.04 22.29,67.86 22.29,71.65 20.47,73.47 LED-VD.B1
LED7_RED  (via drill 0.35)
  Top 0.508: v18.66,63.73 16.51,63.73 R23.2
  Bottom 0.508: v18.66,63.73 19.32,63.73 23.94,68.35 23.94,75.45 25.26,76.77 25.26,77.43 24.77,77.93 19.32,77.93 15.35,73.97 15.35,73.64 LED-VD.B3
MCP2317_1_GPB0
  Top 0.508: MCP23017_1.1 18.99,47.22 18.33,47.22 11.56,40.45 8.75,40.45 7.43,41.77 7.43,42.43 5.28,44.58 FRISCHWASSERTANK.B7
MCP2317_1_GPB1
  Top 0.508: MCP23017_1.2 20.31,47.22 20.31,46.89 13.21,39.79 4.46,39.79 2.81,41.44 2.81,44.91 4.79,46.89 5.12,46.89 FRISCHWASSERTANK.B6
MCP2317_1_GPB2
  Top 0.508: FRISCHWASSERTANK.B5 5.45,49.53 7.43,51.51 7.43,59.77 8.75,61.09 11.56,61.09 12.38,60.26 12.38,57.29 21.46,48.21 21.46,47.38 MCP23017_1.3
MCP2317_1_GPB3  (via drill 0.35)
  Top 0.508: v22.78,49.03 22.78,47.38 MCP23017_1.4 | v10.73,63.56 9.58,63.56 7.76,65.38 7.1,65.38 1.98,60.26 1.98,54.98 4.79,52.17 5.12,52.17 FRISCHWASSERTANK.B4
  Bottom 0.508: v22.78,49.03 22.78,51.51 v10.73,63.56
MCP2317_1_GPB4  (via drill 0.35)
  Top 0.508: v6.27,61.75 11.89,61.75 13.04,60.59 13.04,57.62 17.5,53.16 19.81,53.16 24.11,48.87 24.11,47.38 MCP23017_1.5 | v2.81,57.78 2.81,56.63 4.79,54.65 5.12,54.65 FRISCHWASSERTANK.B3
  Bottom 0.508: v6.27,61.75 4.29,61.75 2.81,60.26 v2.81,57.78
MCP2317_1_GPB5_E  (via drill 0.35)
  Top 0.508: v50.52,42.1 41.11,42.1 38.8,44.41 27.9,44.41 25.43,46.89 25.43,47.22 MCP23017_1.6 | v55.31,13.87 56.3,13.87 58.12,12.05 58.12,6.11 60.26,3.96 v65.71,3.96 | v75.95,3.96 v70.83,3.96 | v88.66,3.3 91.3,5.94 91.3,6.27 GPIO_EXTENSION.B13
  Bottom 0.508: v50.52,42.1 50.52,38.3 50.35,38.14 50.35,18.82 v55.31,13.87 | v70.83,3.96 v65.71,3.96 | v75.95,3.96 77.76,2.15 87.5,2.15 v88.66,3.3
MCP2317_1_GPB6_E  (via drill 0.35)
  Top 0.508: v27.57,45.9 26.75,46.72 26.75,47.22 MCP23017_1.7 | v32.03,37.81 39.29,30.54 v39.29,28.73 | v68.68,2.97 69.84,1.82 89.65,1.82 94.11,6.27 GPIO_EXTENSION.B14
  Bottom 0.508: v27.57,45.9 27.57,42.27 v32.03,37.81 | v39.29,28.73 39.29,16.51 35.83,13.04 35.83,10.9 37.97,8.75 43.59,8.75 46.23,6.11 46.23,4.62 48.87,1.98 62.57,1.98 63.56,2.97 v68.68,2.97
MCP2317_2_GPB3  (via drill 0.35)
  Top 0.508: v70.99,44.25 73.64,46.89 73.64,47.22 MCP23017_2.4 | v55.97,40.62 35.99,40.62 34.01,38.63 14.03,38.63 13.54,38.14 8.59,38.14 7.43,36.98 7.43,26.09 5.61,24.27 5.28,24.27 FÄKALIENTANK.B6
  Bottom 0.508: v70.99,44.25 63.07,44.25 59.44,40.62 v55.97,40.62
MCP2317_2_GPB4  (via drill 0.35)
  Top 0.508: v71.49,43.42 74.79,46.72 74.79,47.22 MCP23017_2.5 | v41.6,39.46 v54.81,39.46 | v33.68,39.46 13.87,39.46 13.54,39.13 3.47,39.13 2.15,37.81 2.15,29.39 4.79,26.75 5.12,26.75 FÄKALIENTANK.B5
  Bottom 0.508: v71.49,43.42 63.23,43.42 59.27,39.46 v54.81,39.46 | v41.6,39.46 40.78,38.63 34.51,38.63 v33.68,39.46
MCP2317_2_GPB5  (via drill 0.35)
  Top 0.508: v75.29,48.54 76.11,47.71 76.11,47.38 MCP23017_2.6 | v65.38,46.39 61.42,46.39 v61.25,46.56 | v51.51,41.94 50.85,41.27 v15.85,41.27 | v3.8,38.3 2.81,37.31 2.81,31.2 4.79,29.22 5.12,29.22 FÄKALIENTANK.B4
  Bottom 0.508: v75.29,48.54 67.53,48.54 v65.38,46.39 | v61.25,46.56 56.13,46.56 v51.51,41.94 | v15.85,41.27 13.37,41.27 11.89,39.79 5.28,39.79 v3.8,38.3
MCP2317_2_GPB6  (via drill 0.35)
  Top 0.508: v77.43,48.87 77.43,47.38 MCP23017_2.7 | v74.46,74.95 72.31,77.1 v24.43,77.1
  Bottom 0.508: v77.43,48.87 77.43,50.19 74.46,53.16 v74.46,74.95 | v24.43,77.1 21.63,74.3 21.63,67.03 20.31,65.71 7.26,65.71 1.65,60.1 1.65,35 4.79,31.86 5.12,31.86 FÄKALIENTANK.B3
N$1  (via drill 0.35)
  Top 0.508: v67.69,53 69.84,50.85 69.84,47.38 MCP23017_2.1 | v72.81,62.24 91.3,62.24 92.62,60.92 R1.1
  Bottom 0.508: v67.69,53 67.69,57.12 v72.81,62.24
N$2
  Top 0.508: MCP23017_2.2 71.16,47.38 71.16,48.21 74.79,51.84 87.67,51.84 90.47,54.65 92.46,54.65 92.95,55.14 92.95,56.96 88.99,60.92 R2.1
N$3  (via drill 0.35)
  Top 0.508: v77.76,51.02 74.95,51.02 72.48,48.54 72.48,47.38 MCP23017_2.3 | v83.54,60.76 85.03,60.76 R3.1
  Bottom 0.508: v77.76,51.02 77.76,52.01 76.77,53 76.77,53.99 v83.54,60.76
N$4
  Top 0.508: MCP23017_2.21 78.75,56.96 78.75,58.28 81.23,60.76 R4.1
N$5
  Top 0.508: MCP23017_2.22 77.43,56.96 77.43,60.76 R5.1
N$6
  Top 0.508: MCP23017_2.23 76.11,56.96 76.11,58.45 73.8,60.76 R6.1
N$7
  Top 0.508: MCP23017_2.24 74.79,56.96 74.79,57.45 72.64,59.6 71.16,59.6 70,60.76 R7.1
N$8
  Top 0.508: MCP23017_2.25 73.64,56.96 73.64,57.29 71.98,58.94 67.86,58.94 66.04,60.76 R8.1
N$9
  Top 0.508: MCP23017_2.26 72.31,56.79 72.31,56.3 71.16,55.14 67.69,55.14 64.55,58.28 60.92,58.28 58.45,60.76 R9.1
N$10
  Top 0.508: MCP23017_2.27 70.99,56.79 70.99,56.3 70.5,55.8 68.02,55.8 64.88,58.94 64.06,58.94 62.24,60.76 R10.1
N$11
  Top 0.508: MCP23017_2.28 69.84,56.96 67.86,56.96 65.22,59.6 64.88,59.6 63.73,60.76 63.73,61.75 63.4,62.08 55.8,62.08 54.65,60.92 R11.1
N$12  (via drill 0.35)
  Top 0.508: v74.79,49.7 77.76,49.7 78.59,48.87 78.59,47.38 MCP23017_2.8 | v68.85,49.7 66.04,49.7 59.44,56.3 55.31,56.3 50.85,60.76 R12.1
  Bottom 0.508: v68.85,49.7 v74.79,49.7
N$13
  Top 0.508: MCP23017_1.21 28.07,56.79 28.07,56.3 29.55,54.81 35.83,54.81 41.77,60.76 41.77,61.91 41.94,62.08 45.73,62.08 46.89,60.92 R15.1
N$14
  Top 0.508: MCP23017_1.22 26.75,56.79 26.75,56.3 28.89,54.15 36.32,54.15 43.09,60.92 R16.1
N$15
  Top 0.508: MCP23017_1.23 25.43,56.96 25.43,57.29 26.42,58.28 35.5,58.28 37.97,60.76 39.29,60.76 R17.1
N$16
  Top 0.508: MCP23017_1.24 24.27,56.96 24.27,57.45 25.76,58.94 33.68,58.94 35.5,60.76 R18.1
N$17
  Top 0.508: MCP23017_1.25 22.78,56.79 22.78,56.3 22.29,55.8 18.49,55.8 18.16,56.13 18.16,61.09 19.15,62.08 30.54,62.08 31.7,60.92 R19.1
N$18
  Top 0.508: MCP23017_1.26 21.63,56.96 21.63,57.29 23.94,59.6 26.75,59.6 27.9,60.76 R20.1
N$19
  Top 0.508: MCP23017_1.27 20.47,56.96 20.47,57.45 23.77,60.76 24.11,60.76 R21.1
N$20
  Top 0.508: MCP23017_1.28 19.15,56.96 19.15,59.6 20.31,60.76 R22.1
N$21
  Top 0.508: MCP23017_2.18 82.55,57.62 81.89,58.28 81.89,58.94 82.55,59.6 87.83,59.6 91.3,56.13 R34.2
N$22  (via drill 0.35)
  Top 0.508: v32.52,55.64 31.86,56.3 31.86,56.79 MCP23017_1.18 | v38.96,55.64 40.28,55.64 40.62,55.97 R35.2
  Bottom 0.508: v38.96,55.64 v32.52,55.64
N$23
  Top 0.508: HX711.E+ 22.95,36.82 22.95,36.32 24.93,34.34 24.93,8.42 22.95,6.44 GASWAAGE.B4
N$24
  Bottom 0.508: HX711.E- 22.78,34.18 22.29,34.18 20.97,32.85 20.97,16.18 24.27,12.88 24.27,9.91 23.11,8.75 22.45,8.75 20.47,6.77 20.47,6.44 GASWAAGE.B3
N$25
  Top 0.508: HX711.A- 22.95,31.7 22.95,31.2 24.27,29.88 24.27,9.91 23.11,8.75 19.81,8.75 17.83,6.77 17.83,6.44 GASWAAGE.B2
N$26
  Top 0.508: HX711.A+ 22.78,29.06 22.78,28.73 13.87,19.81 13.87,7.76 15.19,6.44 GASWAAGE.B1
N$29
  Top 0.508: R23.1 16.51,55.14 17.83,53.82 21.79,53.82 27.9,47.71 27.9,47.38 MCP23017_1.8
RP_GPIO4  (via drill 0.35)
  Top 0.508: v49.53,21.13 v52.67,24.27 | v46.06,22.29 44.58,22.29 36.98,29.88 36.98,31.86 32.52,36.32 v26.91,36.32
  Bottom 0.508: v52.67,24.27 61.75,24.27 62.9,25.43 82.06,25.43 87.34,30.71 87.34,31.86 89.65,34.18 90.47,34.18 91.3,35 91.3,35.83 92.29,36.82 93.12,36.82 96.91,40.62 108.47,40.62 109.13,39.95 109.13,33.68 108.47,33.02 107.48,33.02 106.66,32.19 106.66,31.2 105.99,30.54 105,30.54 104.18,29.72 104.18,26.09 104.84,25.43 105.83,25.43 106.98,24.27 107.81,24.27 RASPBERRY-PI.7 | v49.53,21.13 47.22,21.13 v46.06,22.29 | v26.91,36.32 23.61,33.02 22.12,33.02 21.63,32.52 21.63,16.51 25.26,12.88 25.26,6.27 29.72,1.82 39.46,1.82 43.09,5.45 43.09,6.27 RADAR.B3
RP_GPIO5  (via drill 0.35)
  Top 0.508: v85.19,30.71 85.19,23.61 87.17,21.63 90.64,21.63 91.8,22.78 92.62,22.78 GEHÄUSEDECKEL.16 | v103.35,59.93 103.85,59.93 104.84,60.92 108.64,60.92 v109.13,60.43
  Bottom 0.508: v85.19,30.71 85.19,36.82 85.36,36.98 85.36,53 90.97,58.61 102.03,58.61 v103.35,59.93 | v109.13,60.43 109.13,53.33 107.97,52.17 RASPBERRY-PI.29
RP_GPIO6  (via drill 0.35)
  Top 0.508: RASPBERRY-PI.31 107.81,54.48 106.66,53.33 105,53.33 103.85,52.17 100.55,52.17 R29.2 100.38,51.84 98.56,50.02 98.56,45.4 94.77,41.6 94.77,33.35 93.28,31.86 92.46,31.86 91.47,30.87 91.47,30.05 90.64,29.22 89.81,29.22 v88.16,27.57
  Bottom 0.508: GEHÄUSEDECKEL.13 89.48,26.09 89.32,26.09 88.16,27.24 v88.16,27.57
RP_GPIO7_E  (via drill 0.35)
  Top 0.508: v102.53,45.57 95.43,38.47 95.43,26.42 93.12,24.11 86.18,24.11 v86.02,23.94 | v75.95,13.87 60.59,13.87 59.6,12.88 59.6,9.91 60.76,8.75 69.01,8.75 70.99,6.77 70.99,6.44 GPIO_EXTENSION.B5
  Bottom 0.508: v102.53,45.57 103.85,46.89 105.33,46.89 RASPBERRY-PI.26 | v75.95,13.87 v86.02,23.94
RP_GPIO8_E  (via drill 0.35)
  Top 0.508: v107.31,48.21 106.66,47.55 106.66,46.56 105.5,45.4 105.5,44.58 RASPBERRY-PI.24 | v29.06,35.5 25.59,32.03 25.59,20.31 32.19,13.7 33.52,13.7 35.99,11.23 35.99,4.62 39.29,1.32 64.22,1.32 68.52,5.61 68.52,6.27 GPIO_EXTENSION.B4
  Bottom 0.508: v107.31,48.21 108.31,48.21 109.96,49.86 109.96,65.55 98.07,77.43 64.55,77.43 59.77,72.64 59.77,60.1 54.15,54.48 43.75,54.48 32.85,43.59 32.85,37.48 30.87,35.5 v29.06,35.5
RP_GPIO9_E  (via drill 0.35)
  Top 0.508: v111.11,16.18 111.11,37.97 107.97,41.11 107.97,41.77 RASPBERRY-PI.21
  Bottom 0.508: v111.11,16.18 107.81,12.88 102.86,12.88 101.7,11.72 101.7,5.28 99.56,3.14 89.98,3.14 88.99,4.13 88.33,4.13 86.51,5.94 86.51,6.27 GPIO_EXTENSION.B11
RP_GPIO10_E  (via drill 0.35)
  Top 0.508: v99.06,18 v99.06,21.63
  Bottom 0.508: v99.06,21.63 99.89,22.45 99.89,28.07 104.84,33.02 105.83,33.02 106.66,33.85 106.66,37.31 107.81,38.47 107.81,39.29 RASPBERRY-PI.19 | v99.06,18 99.06,14.2 100.38,12.88 100.38,9.91 99.22,8.75 85.85,8.75 83.87,6.77 83.87,6.44 GPIO_EXTENSION.B10
RP_GPIO12_E  (via drill 0.35)
  Top 0.508: v44.74,18.66 v49.53,23.44 | v36.65,12.71 36.65,4.95 39.46,2.15 v41.6,2.15
  Bottom 0.508: v49.53,23.44 49.53,42.27 55.8,48.54 55.8,53.66 56.63,54.48 59.77,54.48 72.48,67.2 72.48,75.12 74.13,76.77 97.74,76.77 109.13,65.38 109.13,61.75 108.31,60.92 107.48,60.92 106.66,60.1 106.66,56.63 105.5,55.47 105.5,54.65 RASPBERRY-PI.32 | v44.74,18.66 42.6,18.66 v36.65,12.71 | v41.6,2.15 47.71,2.15 48.54,1.32 69.34,1.32 73.64,5.61 73.64,6.27 GPIO_EXTENSION.B6
RP_GPIO13  (via drill 0.35)
  Top 0.508: R28.2 100.55,55.97 106.66,55.97 107.81,57.12 RASPBERRY-PI.33 107.64,56.63 109.13,55.14 109.13,51.51 108.47,50.85 107.48,50.85 106.66,50.02 106.66,49.03 105.83,48.21 104.84,48.21 104.18,47.55 104.18,46.06 v97.9,39.79
  Bottom 0.508: v97.9,39.79 97.08,38.96 97.08,33.85 95.1,31.86 92.46,31.86 91.14,30.54 90.31,30.54 GEHÄUSEDECKEL.9
RP_GPIO14_E  (via drill 0.35)
  Top 0.508: v59.27,19.65 59.27,19.48 63.73,15.02 96.09,15.02 98.23,17.17 101.04,17.17 101.7,17.83 101.7,20.64 104.51,23.44 104.67,23.44 105.33,24.11 RASPBERRY-PI.8 | v51.18,19.65 50.69,19.65 45.57,14.53 v45.4,14.53
  Bottom 0.508: v51.18,19.65 v59.27,19.65 | v45.4,14.53 45.4,7.92 46.89,6.44 46.89,4.95 49.2,2.64 62.24,2.64 63.73,4.13 64.06,4.13 66.04,6.11 GPIO_EXTENSION.B3
RP_GPIO16_E  (via drill 0.35)
  Top 0.508: v90.47,3.96 88.99,2.48 79.74,2.48 76.28,5.94 76.28,6.27 GPIO_EXTENSION.B7
  Bottom 0.508: v90.47,3.96 99.39,3.96 101.04,5.61 101.04,13.21 100.22,14.03 100.22,16.51 101.54,17.83 108.47,17.83 109.13,18.49 109.13,24.77 108.47,25.43 107.48,25.43 106.66,26.25 106.66,27.08 107.48,27.9 108.31,27.9 110.45,30.05 110.45,43.75 108.47,45.73 107.48,45.73 106.66,46.56 106.66,47.55 105.99,48.21 105,48.21 102.86,50.35 102.86,56.3 105.33,58.78 105.33,59.6 RASPBERRY-PI.36
RP_GPIO17  (via drill 0.35)
  Top 0.508: 96.42,34.18 96.42,36.82 97.57,37.97 R25.1 | 96.42,34.18 96.42,32.03 | 96.42,32.03 96.42,28.73 96.91,28.23 96.91,26.75 D1.C | v96.25,34.18 96.42,34.18 | 96.42,32.03 98.56,32.03 98.89,31.7 98.89,29.55 99.39,29.06 101.21,29.06 102.36,27.9 105.83,27.9 106.98,29.06 107.81,29.06 RASPBERRY-PI.11
  Bottom 0.508: GEHÄUSEDECKEL.7 90.97,33.02 92.13,34.18 v96.25,34.18
RP_GPIO18  (via drill 0.35)
  Top 0.508: R24.1 100.55,30.38 104.01,30.38 105.33,29.06 RASPBERRY-PI.12 | v18.33,37.81 13.21,32.69 13.21,3.96 14.36,2.81 29.72,2.81 31.86,4.95 31.86,5.12 33.02,6.27 KüHLSCHR..B3 | v38.3,54.65 43.26,54.65 48.7,60.1 48.7,74.3 v50.69,76.28 | v110.62,46.39 110.62,41.6 v109.63,40.62
  Bottom 0.508: v18.33,37.81 28.4,47.88 31.53,47.88 v38.3,54.65 | v50.69,76.28 62.41,76.28 64.22,78.09 98.4,78.09 110.62,65.88 v110.62,46.39 | v109.63,40.62 109.63,40.45 109.79,40.28 109.79,31.86 108.31,30.38 106.82,30.38 105.5,29.06 RASPBERRY-PI.12
RP_GPIO19  (via drill 0.35)
  Top 0.508: RASPBERRY-PI.35 107.81,59.6 106.66,58.45 103.68,58.45 102.53,59.6 100.55,59.6 R26.2 100.38,59.44 v99.06,59.44 | v89.48,31.7 90.47,31.7 91.3,32.52 91.3,36.16 90.47,36.98 87.67,36.98 v84.53,40.12
  Bottom 0.508: v89.48,31.7 87.34,29.55 87.34,26.58 90.14,23.77 90.14,22.95 GEHÄUSEDECKEL.15 | v84.53,40.12 84.53,53.16 90.64,59.27 98.89,59.27 v99.06,59.44
RP_GPIO20_E  (via drill 0.35)
  Top 0.508: v77.6,53.49 69.51,53.49 v69.34,53.66 | v58.45,17.34 v55.31,20.47
  Bottom 0.508: v77.6,53.49 79.25,55.14 80.73,55.14 86.18,60.59 92.95,60.59 98.4,66.04 105.83,66.04 106.66,65.22 106.66,64.22 105.5,63.07 105.5,62.24 RASPBERRY-PI.38 | v69.34,53.66 68.52,52.83 68.52,52.67 58.78,42.93 56.13,42.93 51.02,37.81 51.02,24.77 v55.31,20.47 | v58.45,17.34 58.45,13.54 59.6,12.38 59.6,9.91 60.76,8.75 76.61,8.75 78.59,6.77 78.59,6.44 GPIO_EXTENSION.B8
RP_GPIO21_E  (via drill 0.35)
  Top 0.508: v72.31,54.32 v80.9,54.32 | v58.28,41.44 58.28,19.48 60.26,17.5 60.26,14.53 58.94,13.21 v58.94,6.44 | v58.28,4.79 60.92,2.15 v63.89,2.15 | v78.09,2.97 v69.84,2.97
  Bottom 0.508: v80.9,54.32 86.51,59.93 93.28,59.93 98.07,64.72 105.33,64.72 RASPBERRY-PI.40 | v72.31,54.32 67.86,49.86 67.69,49.86 59.27,41.44 v58.28,41.44 | v58.94,6.44 58.94,5.45 v58.28,4.79 | v63.89,2.15 69.01,2.15 v69.84,2.97 | v78.09,2.97 81.39,6.27 GPIO_EXTENSION.B9
RP_GPIO22  (via drill 0.35)
  Top 0.508: RASPBERRY-PI.15 107.81,34.34 106.66,35.5 102.86,35.5 101.7,34.34 100.55,34.34 R27.2 100.22,34.34 v99.06,33.19
  Bottom 0.508: v99.06,33.19 95.1,29.22 92.29,29.22 91.14,28.07 90.31,28.07 GEHÄUSEDECKEL.11
RP_GPIO23  (via drill 0.35)
  Top 0.508: 46.06,21.46 36.65,21.46 33.02,25.09 HX711-EXTERN.B3 | 46.06,21.46 46.39,21.46 46.89,21.96 46.89,22.62 41.77,27.74 41.77,30.05 42.1,30.38 44.74,30.38 46.06,31.7 48.21,31.7 HX711.DT | v93.45,26.58 87.67,26.58 v86.02,24.93 | v59.44,17.17 58.78,16.51 v51.35,16.51 | v46.06,21.13 46.06,21.46
  Bottom 0.508: v93.45,26.58 98.89,32.03 102.03,32.03 104.18,34.18 105.33,34.18 RASPBERRY-PI.16 | v86.02,24.93 84.2,24.93 76.44,17.17 v59.44,17.17 | v51.35,16.51 50.69,16.51 v46.06,21.13
RP_GPIO24  (via drill 0.35)
  Top 0.508: 51.84,29.06 48.37,29.06 HX711.SCK | 51.84,29.06 53.82,27.08 53.82,26.42 52.5,25.09 52.34,25.09 45.07,17.83 37.81,17.83 30.54,25.09 30.54,25.43 HX711-EXTERN.B2 | v74.62,75.95 98.56,75.95 111.28,63.23 111.28,48.54 108.47,45.73 107.48,45.73 106.66,44.91 106.66,43.92 105.99,43.26 105,43.26 104.18,42.43 104.18,38.8 105.33,37.64 105.33,36.98 RASPBERRY-PI.18 | v52.01,29.22 51.84,29.06
  Bottom 0.508: v74.62,75.95 74.3,75.95 73.64,75.29 73.64,56.79 59.11,42.27 56.46,42.27 52.01,37.81 v52.01,29.22
RP_GPIO25  (via drill 0.35)
  Top 0.508: v93.61,41.94 87.67,41.94 86.35,43.26 v82.88,43.26 | v78.26,52.67 69.18,52.67 64.72,57.12 v55.64,57.12 | v18.16,43.59 v28.4,43.59
  Bottom 0.508: v93.61,41.94 105.33,41.94 RASPBERRY-PI.22 | v82.88,43.26 82.88,48.04 v78.26,52.67 | v55.64,57.12 41.94,57.12 v28.4,43.59 | v18.16,43.59 14.69,43.59 11.56,40.45 6.6,40.45 5.28,41.77 FRISCHWASSERTANK.B8
RP_GPIO26
  Bottom 0.508: GEHÄUSEDECKEL.2 92.79,40.78 92.79,50.19 100.55,57.95 102.53,57.95 104.18,59.6 104.18,60.26 104.84,60.92 106.49,60.92 107.81,62.24 RASPBERRY-PI.37
RP_GPIO27  (via drill 0.35)
  Top 0.508: v101.87,31.2 104.18,31.2 104.84,30.54 106.66,30.54 107.81,31.7 RASPBERRY-PI.13
  Bottom 0.508: v101.87,31.2 96.09,25.43 92.79,25.43 GEHÄUSEDECKEL.14
RP_GPIO_11_E
  Top 0.508: RASPBERRY-PI.23 107.81,44.41 107.81,43.59 106.66,42.43 106.66,38.96 107.48,38.14 108.31,38.14 110.45,35.99 110.45,17.34 108.31,15.19 107.48,15.19 106.66,16.02 106.66,22.12 105.99,22.78 104.84,22.78 102.36,20.31 102.36,16.02 100.38,14.03 100.38,9.91 99.22,8.75 90.97,8.75 88.99,6.77 88.99,6.44 GPIO_EXTENSION.B12
SCL  (via drill 0.35)
  Top 0.508: 101.04,25.43 101.04,23.44 100.55,22.95 R14.1 100.22,22.95 v99.06,22.95 | 101.04,25.43 101.04,26.58 D1.A | 101.04,25.43 105.83,25.43 106.66,24.6 106.66,23.61 107.81,22.45 107.81,21.63 RASPBERRY-PI.5 | v83.71,45.57 83.71,47.22 MCP23017_2.12 | v81.56,39.13 80.4,39.13 80.07,38.8 I2EXT2.6 | MCP23017_1.12 33.02,47.71 33.68,48.37 36.82,48.37 39.62,45.57 48.54,45.57 50.69,47.71 | 50.69,47.71 53.49,50.52 53.49,51.35 54.32,52.17 55.14,52.17 55.97,53 55.97,53.82 56.63,54.48 60.26,54.48 60.92,53.82 60.92,52.01 60.59,51.68 | 60.59,51.68 59.77,50.85 I2C-EXTENSION.9 | 70.99,41.94 64.55,48.37 63.89,48.37 60.59,51.68 | 70.99,41.94 71.16,41.77 71.16,40.78 69.18,38.8 67.36,38.8 I2EXT1.6 | 50.69,47.71 57.29,41.11 57.29,23.61 46.89,13.21 46.89,9.91 47.71,9.08 53.49,9.08 55.8,6.77 55.8,6.44 ADX345.B4 | v75.45,42.6 71.65,42.6 70.99,41.94 | v88.99,29.72 84.2,34.51 v83.71,34.51
  Bottom 0.508: v83.71,45.57 83.71,41.27 v81.56,39.13 | v75.45,42.6 78.75,39.29 81.39,39.29 v81.56,39.13 | v99.06,22.95 94.27,22.95 92.95,24.27 92.13,24.27 91.3,25.09 91.3,25.92 90.47,26.75 89.65,26.75 88.99,27.41 v88.99,29.72 | v83.71,34.51 83.71,36.98 v81.56,39.13
SDA  (via drill 0.35)
  Top 0.508: v52.83,44.41 39.79,44.41 39.13,45.07 36.16,45.07 34.34,46.89 34.34,47.22 MCP23017_1.13 | 60.84,39.54 60.43,39.95 60.43,48.37 58.45,50.35 58.45,52.17 59.6,53.33 I2C-EXTENSION.10 | 60.84,39.54 61.58,38.8 62.08,38.8 I2EXT1.3 | v100.88,20.64 100.55,20.31 100.55,19.15 R13.1 | v81.23,48.54 84.2,48.54 85.03,47.71 85.03,47.38 MCP23017_2.13 | v71.98,41.77 71.98,41.11 74.3,38.8 74.79,38.8 I2EXT2.3 74.13,38.63 72.31,36.82 72.31,31.53 73.14,30.71 81.39,30.71 82.72,29.39 82.72,25.09 87.01,20.8 v91.63,20.8 | v38.8,3.96 40.95,3.96 42.1,2.81 50.02,2.81 52.17,4.95 52.17,5.12 53.33,6.27 ADX345.B3 | v38.47,16.84 46.39,16.84 54.48,24.93 54.48,28.07 v53.66,28.89 | v60.76,39.46 60.84,39.54
  Bottom 0.508: v52.83,44.41 58.45,50.02 58.45,52.17 59.6,53.33 I2C-EXTENSION.10 | RASPBERRY-PI.3 107.81,19.15 106.66,20.31 105,20.31 104.67,20.64 v100.88,20.64 100.71,20.8 v91.63,20.8 | v81.23,48.54 78.59,48.54 71.98,41.94 v71.98,41.77 71.82,42.1 65.38,42.1 61.75,38.47 | v38.8,3.96 37.64,3.96 35.17,6.44 35.17,13.54 v38.47,16.84 | v53.66,28.89 53.66,30.38 61.75,38.47 | 61.75,38.47 v60.76,39.46

### Text on the board
tNames: V. 4